# Altium schematic sheet Drivers.SchDoc: =SheetTitle_Top
size 420 x 297 mm; Author: G.Kasprowicz; CompanyName: WUT ISE; DrawnBy: G.Kasprowicz; Organization: WUT ISE; Address1: PW ISE; Address2: Nowowiejska 15/19 00-665 Warsaw; Address3: gkasprow@gmail.com; ModifiedBy: -; CheckedDate: -; Title2: EEM transceivers; DivGrp: WUT ISE; Designer: G.Kasprowicz; SPICEModelCachePJWOAGJC: <root> / <DocumentId>PJWOAGJC</DocumentId> / </root>; ModifiedDate: -; ProjectName: Sensor Box
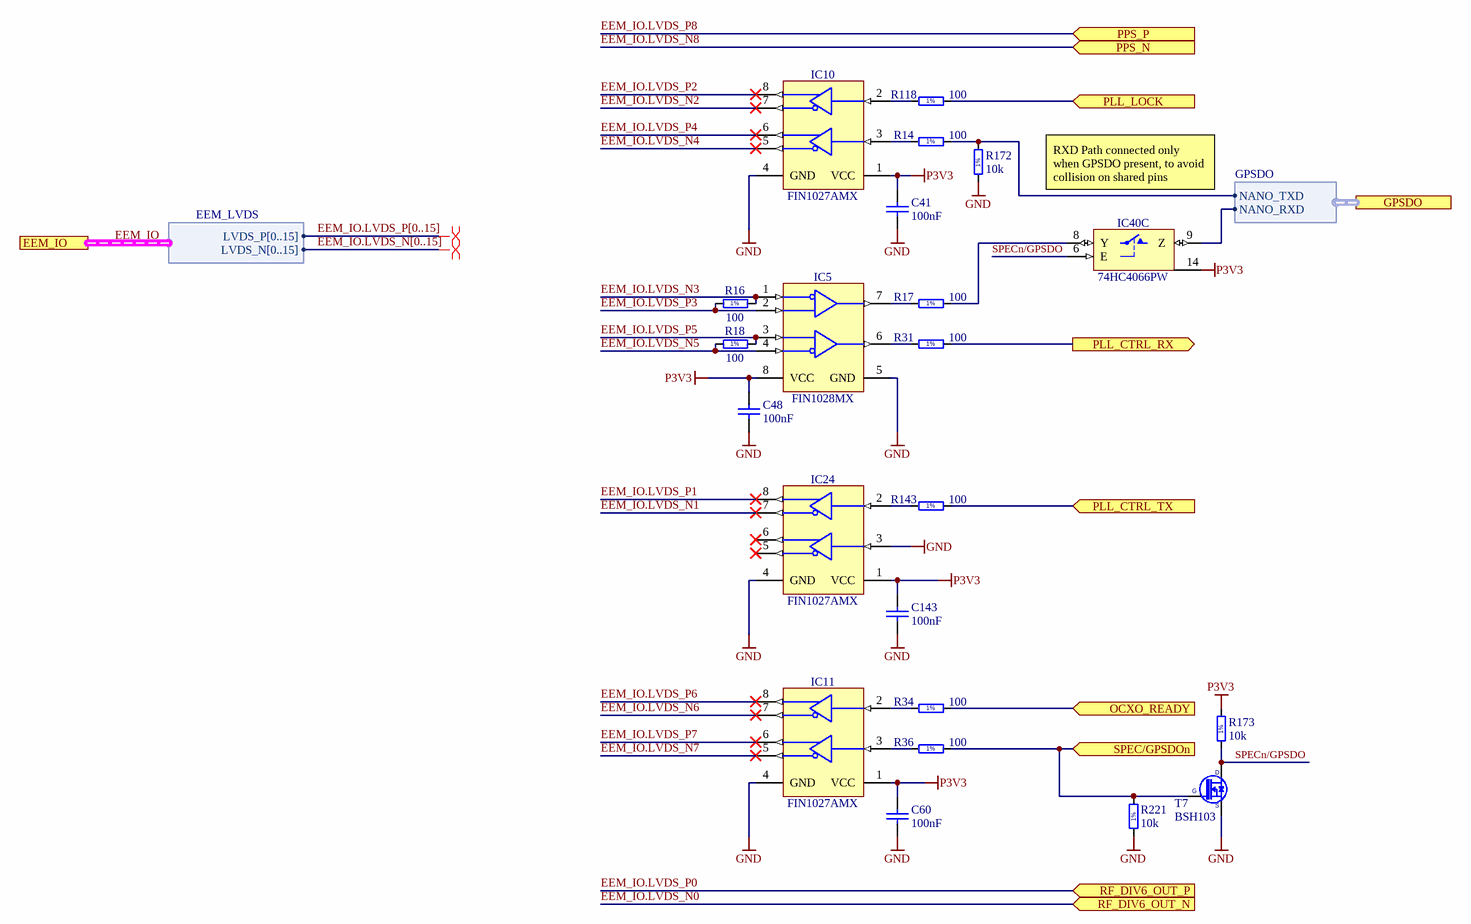
[diagram p0: Drivers.SchDoc]

## Parts
C41  100nF  [CAPC1005X55N]
C48  100nF  [CAPC1005X55N]
C60  100nF  [CAPC1005X55N]
C143  100nF  [CAPC1005X55N]
IC5  FIN1028MX  [SOIC127P600X175-8N]
IC10  FIN1027AMX  [SOIC127P600X175-8N]
IC11  FIN1027AMX  [SOIC127P600X175-8N]
IC24  FIN1027AMX  [SOIC127P600X175-8N]
IC40  74HC4066PW  [SOP65P640X110-14N]  (part C of 4)
R14  100  [RESC1005X40N]
R16  100  [RESC1005X40N]
R17  100  [RESC1005X40N]
R18  100  [RESC1005X40N]
R31  100  [RESC1005X40N]
R34  100  [RESC1005X40N]
R36  100  [RESC1005X40N]
R118  100  [RESC1005X40N]
R143  100  [RESC1005X40N]
R172  10k  [RESC1005X40N]
R173  10k  [RESC1005X40N]
R221  10k  [RESC1005X40N]
T7  BSH103  [SOT95P230X110-3N]

## Ports
EEM_IO (harness EEM_LVDS), GPSDO (harness GPSDO), OCXO_READY (in), PLL_CTRL_RX (out), PLL_CTRL_TX (in), PLL_LOCK (in), PPS_N (in), PPS_P (in), RF_DIV6_OUT_N (in), RF_DIV6_OUT_P (in), SPEC/GPSDOn (in)

## Harnesses
EEM_LVDS: LVDS_P[0..15], LVDS_N[0..15]
GPSDO: NANO_RXD, NANO_TXD

## Nets
GND: C41.1 C48.1 C60.1 C143.1 IC5.5(GND) IC10.4(GND) IC11.4(GND) IC24.3(DIN2RIN-) IC24.4(GND) IC40.7(GND) R172.1 R221.1 T7.2(S)
P3V3: C41.2 C48.2 C60.2 C143.2 IC5.8(VCC) IC10.1(VCC) IC11.1(VCC) IC24.1(VCC) IC40.14(VCC) R173.2
EEM_IO.LVDS_N0: port RF_DIV6_OUT_N
EEM_IO.LVDS_N1: IC24.7(DOUT-)
EEM_IO.LVDS_N2: IC10.7(DOUT-)
EEM_IO.LVDS_N3: IC5.1(RIN1-) R16.1
EEM_IO.LVDS_N4: IC10.5(DOUT-)
EEM_IO.LVDS_N5: IC5.4(RIN2-) R18.2
EEM_IO.LVDS_N6: IC11.7(DOUT-)
EEM_IO.LVDS_N7: IC11.5(DOUT-)
EEM_IO.LVDS_N8: port PPS_N
EEM_IO.LVDS_P0: port RF_DIV6_OUT_P
EEM_IO.LVDS_P1: IC24.8(DOUT+)
EEM_IO.LVDS_P2: IC10.8(DOUT+)
EEM_IO.LVDS_P3: IC5.2(RIN1+) R16.2
EEM_IO.LVDS_P4: IC10.6(DOUT+)
EEM_IO.LVDS_P5: IC5.3(RIN2+) R18.1
EEM_IO.LVDS_P6: IC11.8(DOUT+)
EEM_IO.LVDS_P7: IC11.6(DOUT+)
EEM_IO.LVDS_P8: port PPS_P
OCXO_READY: R34.1 ; port OCXO_READY
PLL_CTRL_RX: R31.1 ; port PLL_CTRL_RX
PLL_CTRL_TX: R143.1 ; port PLL_CTRL_TX
PLL_LOCK: R118.1 ; port PLL_LOCK
SPEC/GPSDOn: R36.1 R221.2 T7.1(G) ; port SPEC/GPSDOn
SPECn/GPSDO: IC40.6(E) R173.1 T7.3(D)
NetIC5_6: IC5.6(ROUT2) R31.2
NetIC5_7: IC5.7(ROUT1) R17.2
NetIC10_2: IC10.2(DIN1) R118.2
NetIC10_3: IC10.3(DIN2RIN-) R14.2
NetIC11_2: IC11.2(DIN1) R34.2
NetIC11_3: IC11.3(DIN2RIN-) R36.2
NetIC24_2: IC24.2(DIN1) R143.2
NetIC40_8: IC40.8(Y) R17.1
NetIC40_9: IC40.9(Z) ; port GPSDO.NANO_RXD
NetR14_1: R14.1 R172.2 ; port GPSDO.NANO_TXD

Not connected (* = marked no-connect by the designer): IC24 5(DOUT-)* 6(DOUT+)*

## Buses and harness runs
bus EEM_IO.LVDS_N[0..15]
bus EEM_IO.LVDS_P[0..15]
harness EEM_IO = port EEM_IO

## Layout directives
differential pair; differential pair class Diff_100Ohm: (no net found under the mark)

## Notes on the sheet
- RXD Path connected only when GPSDO present, to avoid collision on shared pins
- Project/Equipment
- Document
- Designer
- Drawn by
- Check.by
- Copyright WUT ISE 2020.
  This documentation describes Open Hardware and is licensed under the CERN OHL v.1.2. You may redistribute and modify this documentation under the terms of the CERN OHL v.1.2. (http://ohwr.org/CERNOHL). This documentation is distributed WITHOUT ANY EXPRESS OR IMPLIED WARRANTY, INCLUDING OF MERCHANTABILITY, SATISFACTORY QUALITY AND FITNESS FOR A PARTICULAR PURPOSE. Please see the CERN OHL v.1.2 for applicable conditions.
- Contact
- File
- Last Mod.
- Print Date
- Sheet
- Size
- A3
- of
- Rev
- (in symbol R0402_10K_1%_0.0625W_100PPM) 1%
- (in symbol R0402_100R_1%_0.0625W_100PPM) 1%

## Library data of the parts
C41 C48 C60 C143 = CC0402_100NF_16V_10%_X5R: Non-polarised capacitor; Part Description: SMD Multilayer Chip Ceramic Capacitor; Manufacturer: GENERIC; Manufacturer1 Part Number: GRM155R61C104KA88D; Voltage: 16V; TC: X5R; Tolerance: ±10%; Part Number: CC0402_100NF_16V_10%_X5R; Component Kind: Standard; Component Type: Standard; Pin Count: 2; Value: 100nF; Status: None; Manufacturer Part Number: CC0402_100NF_16V_10%_X5R; Case: 0402; Mounted: Yes; Socket: No; SMD: Yes; Sense: No; Manufacturer1 Example: MURATA; Manufacturer1 ComponentHeight: 0.55mm; HelpURL: \\cern.ch\dfs\Applications\Altium\Datasheets\CC0402_X5R_MURATA_GRM.pdf; Author: CERN DEM JLC; CreateDate: 10.12.2013; LatestRevisionDate: 10.12.2013
IC5 = IFC_FIN1028: 3.3V LVDS 2-Bit High-Speed Differential Reciever; Manufacturer: ON Semiconductor; PressFit: No; Bonding: No; Part Number: FIN1028MX; Component Kind: Standard; Component Type: Standard; Device: FIN1028MX; PackageDescription: SOIC 8, Pitch 1.27mm - Body 4x5mm, IPC Medium Density; Part Description: 3.3V LVDS 2-Bit High-Speed Differential Reciever; Manufacturer Part Number: FIN1028MX; Pin Count: 8; Case: SOIC8; Mounted: Yes; Socket: No; SMD: Yes; Sense: No; ComponentHeight: 0.8mm; Author: GK; HelpURL: \\cern.ch\dfs\Applications\Altium\Datasheets\FIN1101K8X.pdf; CreateDate: 08/11/2016; LatestRevisionDate: 08/11/2016
IC10 IC11 IC24 = IFC_FIN1027A: 3.3V LVDS, 2-Bit, High-Speed, Differential Driver; Manufacturer: ON Semiconductor; PressFit: No; Bonding: No; Part Number: FIN1027AMX; Component Kind: Standard; Component Type: Standard; Device: FIN1027AMX; PackageDescription: SOIC 8, Pitch 1.27mm - Body 4x5mm, IPC Medium Density; Part Description: 3.3V LVDS, 2-Bit, High-Speed, Differential Driver; Manufacturer Part Number: FIN1027AMX; Pin Count: 8; Case: SOIC8; Mounted: Yes; Socket: No; SMD: Yes; Sense: No; ComponentHeight: 0.8mm; Author: GK; HelpURL: \\cern.ch\dfs\Applications\Altium\Datasheets\FIN1101K8X.pdf; CreateDate: 08/11/2016; LatestRevisionDate: 08/11/2016
IC40 = 74HC4066PW: Part Description: Quad Single-Pole Single-Throw Analog Switch; Manufacturer: NXP SEMICONDUCTORS; PressFit: No; Bonding: No; Table: Standard Logic; Part Number: 74HC4066PW; Component Kind: Standard; Component Type: Standard; Device: 74HC4066PW; PackageDescription: SOP, 14-Leads, Body 4.4x5mm (max), Pitch 0.65mm, IPC Medium Density; Manufacturer Part Number: 74HC4066PW; Pin Count: 14; Case: TSSOP14; Mounted: Yes; Socket: No; SMD: Yes; ComponentHeight: 1.1mm; Author: CERN DEM JLC; HelpURL: \\cern.ch\dfs\Applications\Altium\Datasheets\74HC4066PW.pdf; CreateDate: 2014-11-19; LatestRevisionDate: 2014-11-19
R14 R16-R18 R31 R34 R36 R118 R143 = R0402_100R_1%_0.0625W_100PPM: Resistor - 1%; Part Description: General Purpose Thick Film Chip Resistor; Manufacturer: GENERIC; Manufacturer1 Part Number: 232270671001L; TC: ±100ppm/°C; PressFit: No; Part Number: R0402_100R_1%_0.0625W_100PPM; Component Kind: Standard; Component Type: Standard; Pin Count: 2; Value: 100; Status: Not Recommended; Power: 0.0625W; Tolerance: ±1%; Manufacturer Part Number: R0402_100R_1%_0.0625W_100PPM; Case: 0402; Mounted: Yes; Sense: No; Socket: No; SMD: Yes; Manufacturer1 Example: YAGEO PHYCOMP; Manufacturer1 ComponentHeight: 0.4mm; HelpURL: \\cern.ch\dfs\Applications\Altium\Datasheets\R0402_Phycomp_RC0402.pdf; Author: CERN DEM JLC; CreateDate: 03.12.2007; LatestRevisionDate: 17.10.2012
R172 R173 R221 = R0402_10K_1%_0.0625W_100PPM: Resistor - 1%; Part Description: General Purpose Thick Film Chip Resistor; Manufacturer: GENERIC; Manufacturer1 Part Number: 232270671003L; TC: ±100ppm/°C; PressFit: No; Part Number: R0402_10K_1%_0.0625W_100PPM; Component Kind: Standard; Component Type: Standard; Pin Count: 2; Value: 10k; Status: Not Recommended; Power: 0.0625W; Tolerance: ±1%; Manufacturer Part Number: R0402_10K_1%_0.0625W_100PPM; Case: 0402; Mounted: Yes; Sense: No; Socket: No; SMD: Yes; Manufacturer1 Example: YAGEO PHYCOMP; Manufacturer1 ComponentHeight: 0.4mm; HelpURL: \\cern.ch\dfs\Applications\Altium\Datasheets\R0402_Phycomp_RC0402.pdf; Author: CERN DEM JLC; CreateDate: 03.12.2007; LatestRevisionDate: 17.10.2012
T7 = BSH103: N-CHANNEL MOSFET WITH DIODE; Part Description: 30V 850mA N-Channel Enhancement Mode Field-Effect Transistor; Manufacturer: NEXPERIA; PressFit: No; Bonding: No; Part Number: BSH103; Component Kind: Standard; Component Type: Standard; Device: BSH103; PackageDescription: SOT23, 0.95mm Pitch; 3 Pin, 1.30mm W X 2.90mm L X 1.10mm H body, IPC Medium Density; Manufacturer Part Number: BSH103; Pin Count: 3; Case: SOT23-3; Mounted: Yes; Socket: No; SMD: Yes; Sense: No; ComponentHeight: 1.1mm; HelpURL: \\cern.ch\dfs\Applications\Altium\Datasheets\BSH103.pdf; Author: CERN DEM JLC; CreateDate: 16.03.2010; LatestRevisionDate: 20.06.2017